# Altium schematic sheet Hw_Sch.SchDoc
size A2
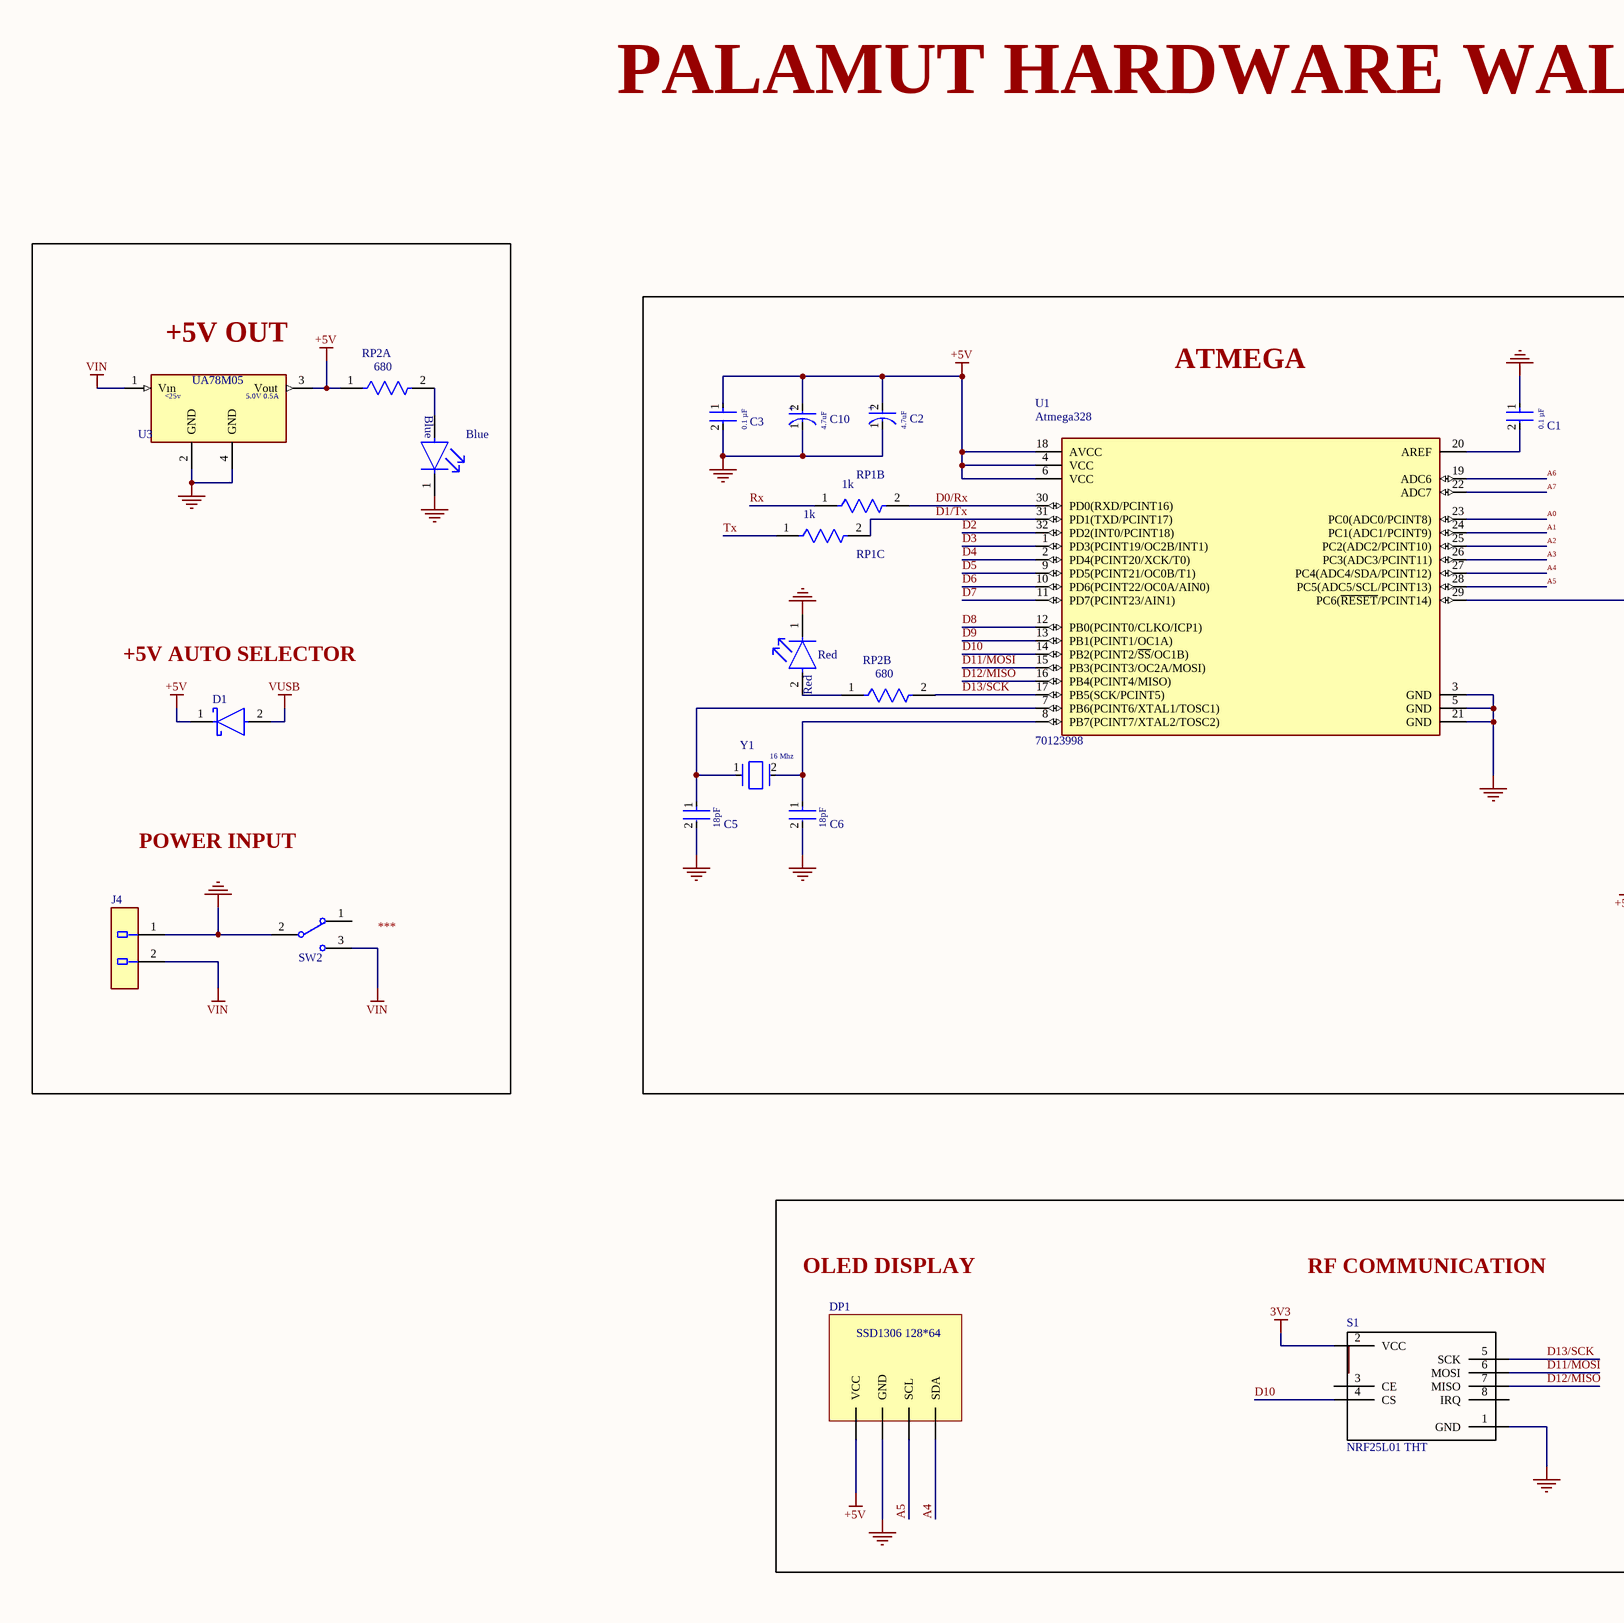
[diagram p0: Hw_Sch.SchDoc, left]
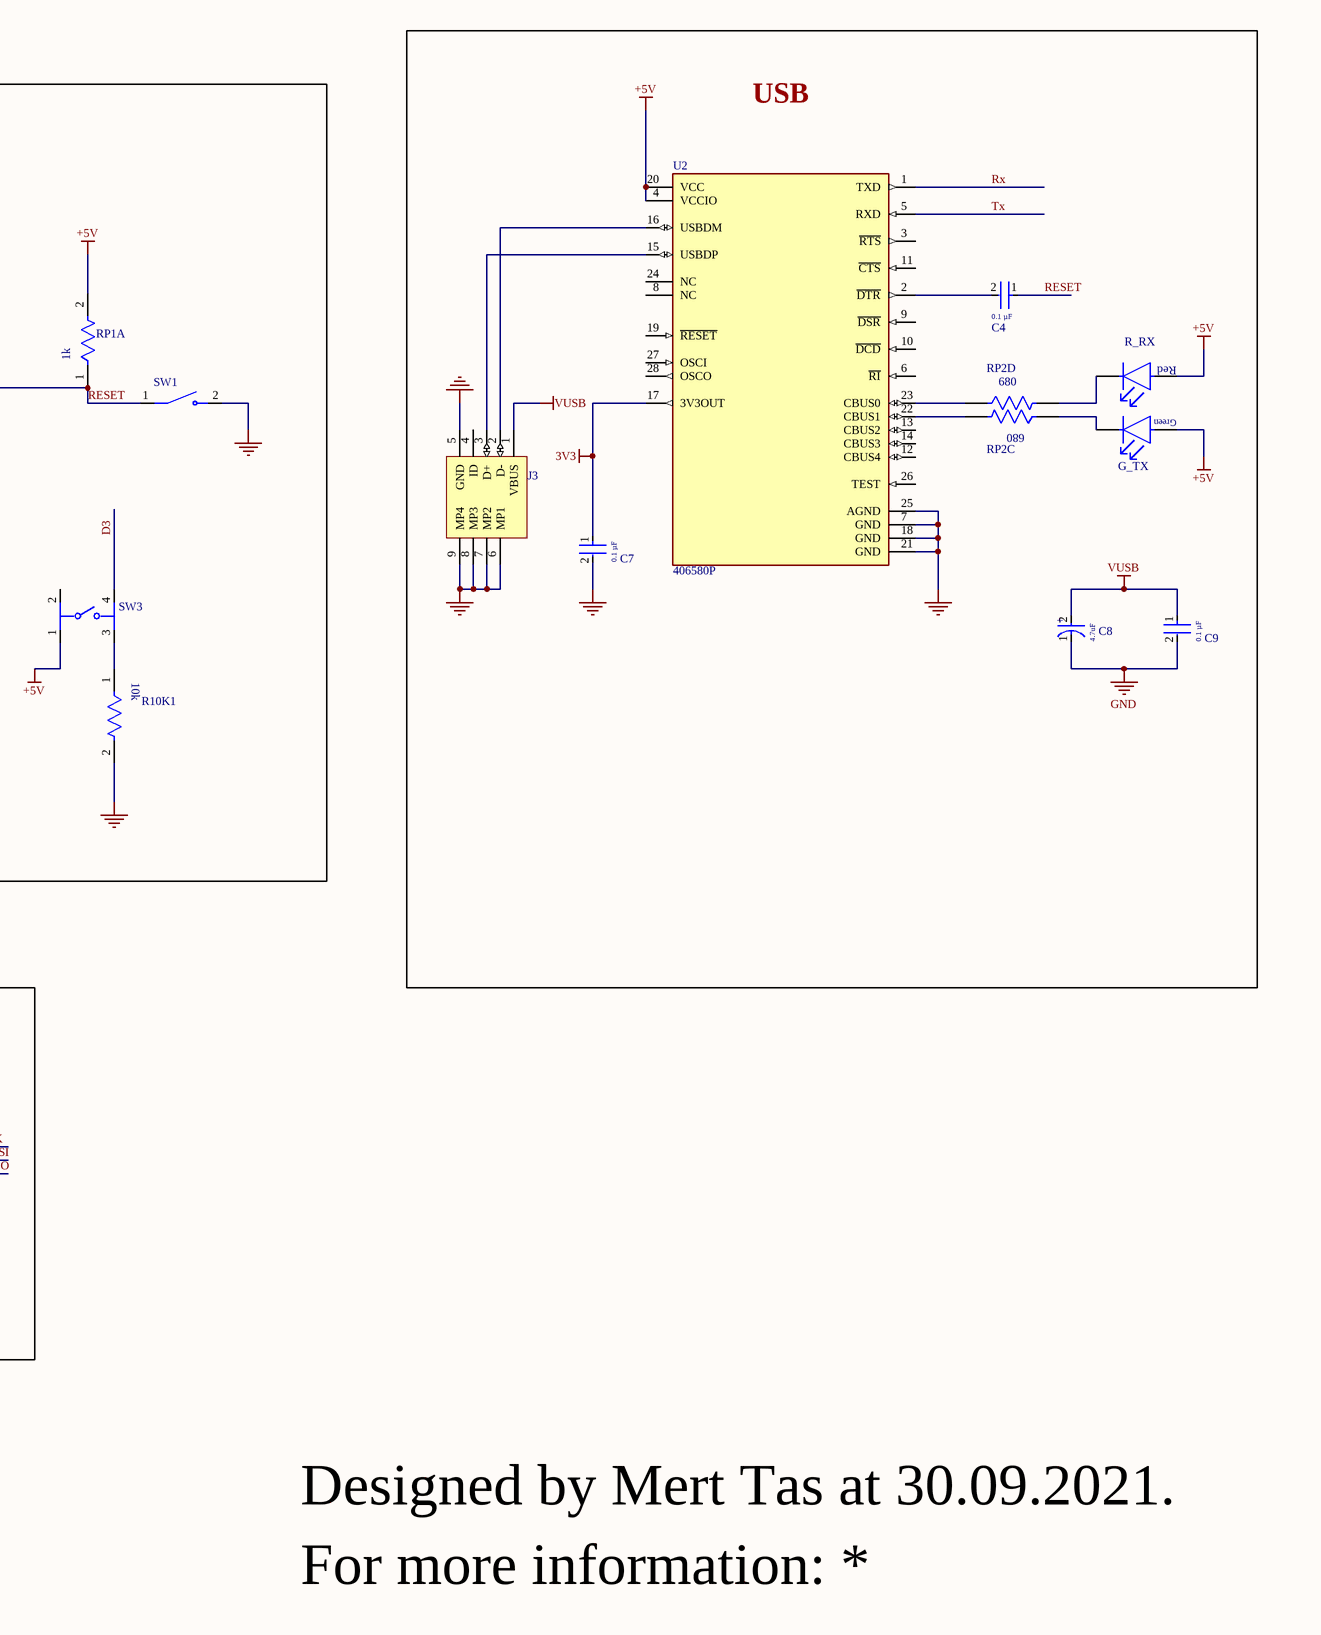
[diagram p1: Hw_Sch.SchDoc, right]

## Parts
Blue  LTST-C170TBKT  [Lite-On_0_MFG]  (value not drawn)
C1  C0805C104K5RACTU  [KEMET_C0805C-DN_IPC_A]  (value not drawn)
C2  T491A475K010AT  [Kemet_T491A475K010AT_0]  (value not drawn)
C3  C0805C104K5RACTU  [KEMET_C0805C-DN_IPC_A]  (value not drawn)
C4  C0805C104K5RACTU  [KEMET_C0805C-DN_IPC_A]  (value not drawn)
C5  C0805C180J5GACTU  [KEMET_C0805C-DN_IPC_A - duplicate]  (value not drawn)
C6  C0805C180J5GACTU  [KEMET_C0805C-DN_IPC_A - duplicate]  (value not drawn)
C7  C0805C104K5RACTU  [KEMET_C0805C-DN_IPC_A]  (value not drawn)
C8  T491A475K010AT  [Kemet_T491A475K010AT_0]  (value not drawn)
C9  C0805C104K5RACTU  [KEMET_C0805C-DN_IPC_A]  (value not drawn)
C10  T491A475K010AT  [Kemet_T491A475K010AT_0]  (value not drawn)
D1  MBR0520LT1G  [On_Semiconductor_425-04_IPC_A]  (value not drawn)
DP1  SSD1306 0.96 inch  [SSD1306 128*64]  (value not drawn)
G_TX  APHCM2012CGCK-F01  [Kingbright_0_MFG]  (value not drawn)
J3  67503-1020  [MOLX-67503-1020_V]  (value not drawn)
J4  S2B-PH-K-S_LF_SN  [JST_S2B-PH-K-S_LF_SN_0]  (value not drawn)
R10K1  MCT0603MD1002DP500  [Vishay_MCT0603_IPC_A]  (value not drawn)
R_RX  APT2012SRCPRV  [Kingbright_APT2012SRCPRV_0]  (value not drawn)
Red  APT2012SRCPRV  [Kingbright_APT2012SRCPRV_0]  (value not drawn)
RP1A  RC0603FR-071KL  [Yageo_RC0603_IPC_A - duplicate]  (value not drawn)
RP1B  RC0603FR-071KL  [Yageo_RC0603_IPC_A - duplicate]  (value not drawn)
RP1C  RC0603FR-071KL  [Yageo_RC0603_IPC_A - duplicate]  (value not drawn)
RP2A  RC0603FR-07680RL  [Yageo_RC0603_IPC_A]  (value not drawn)
RP2B  RC0603FR-07680RL  [Yageo_RC0603_IPC_A]  (value not drawn)
RP2C  RC0603FR-07680RL  [Yageo_RC0603_IPC_A]  (value not drawn)
RP2D  RC0603FR-07680RL  [Yageo_RC0603_IPC_A]  (value not drawn)
S1  NRF25L01 THT  [NRF25L01 THT]
SW1  B3U-1000P  [Omron_0_MFG]  (value not drawn)
SW2  EG1218  [ESWI-EG1218_V]  (value not drawn)
SW3  B3SL-1002P  [Omron_B3SL-1022P_0]  (value not drawn)
U1  Supplier Part Number 1: 70123998  [Microchip_32A_IPC_A]  (hidden comment: ATMEGA168-20AU)
U2  Supplier Part Number 1: 406580P  [FTDI_SSOP-28_IPC_A]  (hidden comment: FT232RL-REEL)
U3  UA78M05CDCYR  [Texas_Instruments_DCY0004A_IPC_A]  (value not drawn)
Y1  Crys_CTS_ATS16B_eec  [CTS_ATS16B_0]  (value not drawn)

## Blocks framed on the sheet
+5V OUT: Blue D1 J4 RP2A SW2 U3
USB: C4 C7-C9 G_TX J3 R_RX RP2C RP2D U2
ATMEGA: C1-C3 C5 C6 C10 R10K1 Red RP1A RP1B RP1C RP2B SW1 SW3 U1 Y1
OLED DISPLAY: DP1 S1

## Nets
3V3: C7.1 S1.2(VCC) U2.17(3V3OUT)
+5V: C2.2(A) C3.1 C10.2(A) D1.1(C) DP1.1(VCC) G_TX.2(A) R_RX.2(A) RP1A.2 RP2A.1 SW3.1 U1.4(VCC) U1.6(VCC) U1.18(AVCC) U2.4(VCCIO) U2.20(VCC) U3.3(Vout)
GND: Blue.1(C) C1.1 C2.1(C) C3.2 C5.2 C6.2 C7.2 C8.1(C) C9.2 C10.1(C) DP1.2(GND) J3.5(GND) J3.6(MP1) J3.7(MP2) J3.8(MP3) J3.9(MP4) J4.1 R10K1.2 Red.1(C) S1.1(GND) SW1.2 SW2.2(COM) U1.3(GND) U1.5(GND) U1.21(GND) U2.7(GND) U2.18(GND) U2.21(GND) U2.25(AGND) U3.2(GND) U3.4(GND)
VIN: J4.2 SW2.3 U3.1(Vın)
VUSB: C8.2(A) C9.1 D1.2(A) J3.1(VBUS)
A0: U1.23(PC0(ADC0/PCINT8))
A1: U1.24(PC1(ADC1/PCINT9))
A2: U1.25(PC2(ADC2/PCINT10))
A3: U1.26(PC3(ADC3/PCINT11))
A4: DP1.4(SDA) U1.27(PC4(ADC4/SDA/PCINT12))
A5: DP1.3(SCL) U1.28(PC5(ADC5/SCL/PCINT13))
A6: U1.19(ADC6)
A7: U1.22(ADC7)
D0/Rx: RP1B.2 U1.30(PD0(RXD/PCINT16))
D1/Tx: RP1C.2 U1.31(PD1(TXD/PCINT17))
D2: U1.32(PD2(INT0/PCINT18))
D3: SW3.4 U1.1(PD3(PCINT19/OC2B/INT1))
D4: U1.2(PD4(PCINT20/XCK/T0))
D5: U1.9(PD5(PCINT21/OC0B/T1))
D6: U1.10(PD6(PCINT22/OC0A/AIN0))
D7: U1.11(PD7(PCINT23/AIN1))
D8: U1.12(PB0(PCINT0/CLKO/ICP1))
D9: U1.13(PB1(PCINT1/OC1A))
D10: S1.4(CS) U1.14(PB2(PCINT2/~{SS}/OC1B))
D11/MOSI: S1.6(MOSI) U1.15(PB3(PCINT3/OC2A/MOSI))
D12/MISO: S1.7(MISO) U1.16(PB4(PCINT4/MISO))
D13/SCK: RP2B.2 S1.5(SCK) U1.17(PB5(SCK/PCINT5))
RESET: C4.1 RP1A.1 SW1.1 U1.29(PC6(~{RESET}/PCINT14))
Rx: RP1B.1 U2.1(TXD)
Tx: RP1C.1 U2.5(RXD)
NetBlue_2: Blue.2(A) RP2A.2
NetC1_2: C1.2 U1.20(AREF)
NetC4_2: C4.2 U2.2(~{DTR})
NetC5_1: C5.1 U1.7(PB6(PCINT6/XTAL1/TOSC1)) Y1.1
NetC6_1: C6.1 U1.8(PB7(PCINT7/XTAL2/TOSC2)) Y1.2
NetG_TX_1: G_TX.1(C) RP2C.1
NetJ3_2: J3.2(D-) U2.16(USBDM)
NetJ3_3: J3.3(D+) U2.15(USBDP)
NetR10K1_1: R10K1.1 SW3.3
NetR_RX_1: R_RX.1(C) RP2D.2
NetRed_2: Red.2(A) RP2B.1
NetRP2C_2: RP2C.2 U2.22(CBUS1)
NetRP2D_1: RP2D.1 U2.23(CBUS0)

Not connected (* = marked no-connect by the designer): J3 4(ID); S1 3(CE) 8(IRQ); SW2 1; SW3 2; U2 3(~{RTS}) 6(~{RI}) 8(NC) 9(~{DSR}) 10(~{DCD}) 11(~{CTS}) 12(CBUS4) 13(CBUS2) 14(CBUS3) 19(~{RESET}) 24(NC) 26(TEST) 27(OSCI) 28(OSCO)

## Notes on the sheet
- PALAMUT HARDWARE WALLET MARK I
- +5V AUTO SELECTOR
- POWER INPUT
- (near SW2) ***
- RF COMMUNICATION
- Designed by Mert Tas at 30.09.2021.
- For more information: *
- (in symbol APHCM2012CGCK-F01) Green
- (in symbol APT2012SRCPRV) Red
- (in symbol ATMEGA168-20AU) Atmega328
- (in symbol C0805C104K5RACTU) 0.1 µF
- (in symbol C0805C180J5GACTU) 18pF
- (in symbol Crys_CTS_ATS16B_eec) 16 Mhz
- (in symbol MCT0603MD1002DP500) 10k
- (in symbol RC0603FR-071KL) 1k
- (in symbol RC0603FR-07680RL) 680
- (in symbol SSD1306 0.96 inch) SSD1306 128*64
- (in symbol T491A475K010AT) +; 4.7uF
- (in symbol UA78M05CDCYR) UA78M05; <25v; 5.0V 0.5A

## Library data of the parts
J3 = 67503-1020: USB, MINI, SMD, RA KME04-USBMU03A01; Manufacturer: Molex; ComponentLink1Description: Manufacturer URL; ComponentLink2Description: Datasheet; DatasheetVersion: Rev F, 06/2009; Mounting Technology: Surface Mount; ComponentLink1URL: http://www.molex.com/; Terminal Pitch: 0.8 mm; PartNumber: 67503-1020; PackageReference: 67503-1020; PackageDescription: Mini USB Connector, SMT, Righer Angle; ComponentLink2URL: http://www.molex.com/pdm_docs/sd/675031020_sd.pdf; Supplier 1: Farnell; Supplier Part Number 1: 1125348
SW1 = B3U-1000P: Tactile Switch SPST-NO Top Actuated Surface Mount; MF: Omron; SnapEDA_Link: https://www.snapeda.com/parts/B3U-1000P/Omron%20Electronics%20Inc-EMC%20Div/view-part/104326/?ref=snap; MP: B3U-1000P; Value: *; Digi-Key_Purchase_URL: https://www.digikey.com/product-detail/en/omron-electronics-inc-emc-div/B3U-1000P/SW1020CT-ND/1534357?utm_source=snapeda&utm_medium=aggregator&utm_campaign=symbol; Digi-Key_Part_Number: SW1020CT-ND; Package: None; Supplier 1: Mouser; Supplier Part Number 1: 653-B3U-1000P-B
SW2 = EG1218: Slide Switch, 500 V, -20 to 70 degC, 3-Pin THD, RoHS; Outputs: 1; Max Ouput Current: 150 mA; Max Power Dissipation: 250 mW; Min Input Voltage: 4.3 V; Max Input Voltage: 8 V; Case\Package: SOT-23-5; Output Voltage: 3.3 V; Dropout Voltage: 300 mV; RoHSCompliant: true; Min Operating Temperature: -40 degC; Width: 1.8 mm; Max Operating Temperature: 85 degC; ComponentLink1Description: Manufacturer URL; ComponentLink2Description: Datasheet; DatasheetVersion: Oct-15; ComponentLink1URL: http://www.e-switch.ch/en/; ComponentLink2URL: https://www.e-switch.com/system/asset/product_line/data_sheet/119/EG.pdf; PackageReference: EG1218; Pins: 5; REACH SVHC: No SVHC; Mount: Surface Mount; Length: 3 mm; Radiation Hardening: No; Output Current: 150 mA; Package Quantity: 3000; Height: 1.3 mm; Packaging: Tape and Reel; Nominal Output Voltage: 3.3 V; Power Rating: 250 mW; PackageDescription: 3-Pin Through Hole Device, Body 11.6 x 4 mm, Pitch 2.5 mm; PartNumber: EG1218; Supplier 1: Farnell; Supplier Part Number 1: 2787232
Y1 = Crys_CTS_ATS16B_eec: CRYSTAL 16.0000MHZ 18PF T/H; Part Number: ATS16B; Manufacturer: CTS; Resistance: 40Ω; Capacitance: 18.0pF; Value: 18.0pF; Frequency Tolerance: ±30ppm; Frequency Stability: ±50ppm; Frequency: 16MHz; helpURL: https://upverter.com/upn/revision/339e0baabf11f92b/; ComponentLink2Description: Datasheet; Temperature: -20°C to +70°C; Package: PTH_XTAL_10MM85_4MM5; Supplier 2: Mouser; Price: 0.245333334185; Supplier 1: Digi-Key; ComponentLink1URL: https://upverter.com/upn/revision/339e0baabf11f92b/; Supplier Part Number 2: 774-ATS16B; Supplier Part Number 1: CTX1085-ND; ComponentLink1Description: Upverter; ComponentLink2URL: https://upverter.com/datasheet/1e3504e19249f7256f0c1479324b6da4eb869fd1.pdf; RoHS: TRUE; Mouser Part Number: 774-ATS16B; Ipc Land Pattern Name: CAPAD488W65L1085D450; Temperature Range High: +70°C; Temperature Range Low: -20°C; Digikey Part Number: CTX1085-ND; ESR: 40Ω; Lead Free: yes; Digikey Description: CRYSTAL 16.0000MHZ 18PF T/H; Load Capacitance: 18pF; Supplier 3: Mouser; Supplier Part Number 3: 815-ABL-16-B2
Blue = LTST-C170TBKT: Supplier 1: Arrow Electronics; Supplier 2: RSComponents; Supplier Part Number 1: LTST-C170TBKT; Supplier Part Number 2: 6920913
C1 C3 C4 C7 C9 = C0805C104K5RACTU: Supplier 1: Farnell; Supplier Part Number 1: 1414664
C2 C8 C10 = T491A475K010AT: Supplier 1: Farnell; Supplier Part Number 1: 1457427
C5 C6 = C0805C180J5GACTU: Supplier 1: Farnell; Supplier Part Number 1: 1414673
D1 = MBR0520LT1G: Supplier 1: Farnell; Supplier Part Number 1: 9556915
G_TX = APHCM2012CGCK-F01: Supplier 1: Mouser; Supplier Part Number 1: 604-APHCM2012CGCK
J4 = S2B-PH-K-S_LF_SN: Supplier 1: Digi-Key; Supplier Part Number 1: 455-1719-ND
R10K1 = MCT0603MD1002DP500: Supplier 1: Farnell; Supplier Part Number 1: 1713653
R_RX Red = APT2012SRCPRV: Supplier 1: Mouser; Supplier Part Number 1: 604-APT1608SECK
RP1A RP1B RP1C = RC0603FR-071KL: Supplier 1: Farnell; Supplier Part Number 1: 9238484
RP2A RP2B RP2C RP2D = RC0603FR-07680RL: Supplier 1: Farnell; Supplier Part Number 1: 9238468RL
SW3 = B3SL-1002P: Supplier 1: Farnell; Supplier Part Number 1: 2126683
U1 = ATMEGA168-20AU: Supplier 1: Allied Electronics
U2 = FT232RL-REEL: Supplier 1: RSComponents
U3 = UA78M05CDCYR: Supplier 1: Digi-Key; Supplier 2: Farnell; Supplier 3: Digi-Key; Supplier Part Number 1: 296-12290-1-ND; Supplier Part Number 2: 3008100RL; Supplier Part Number 3: 296-12290-6-ND